# Altium project all-in-one-board-for-open-inverter-project--main.PrjPcb (part 2 of 2)

## Sheet Mosfets.SchDoc
size A3
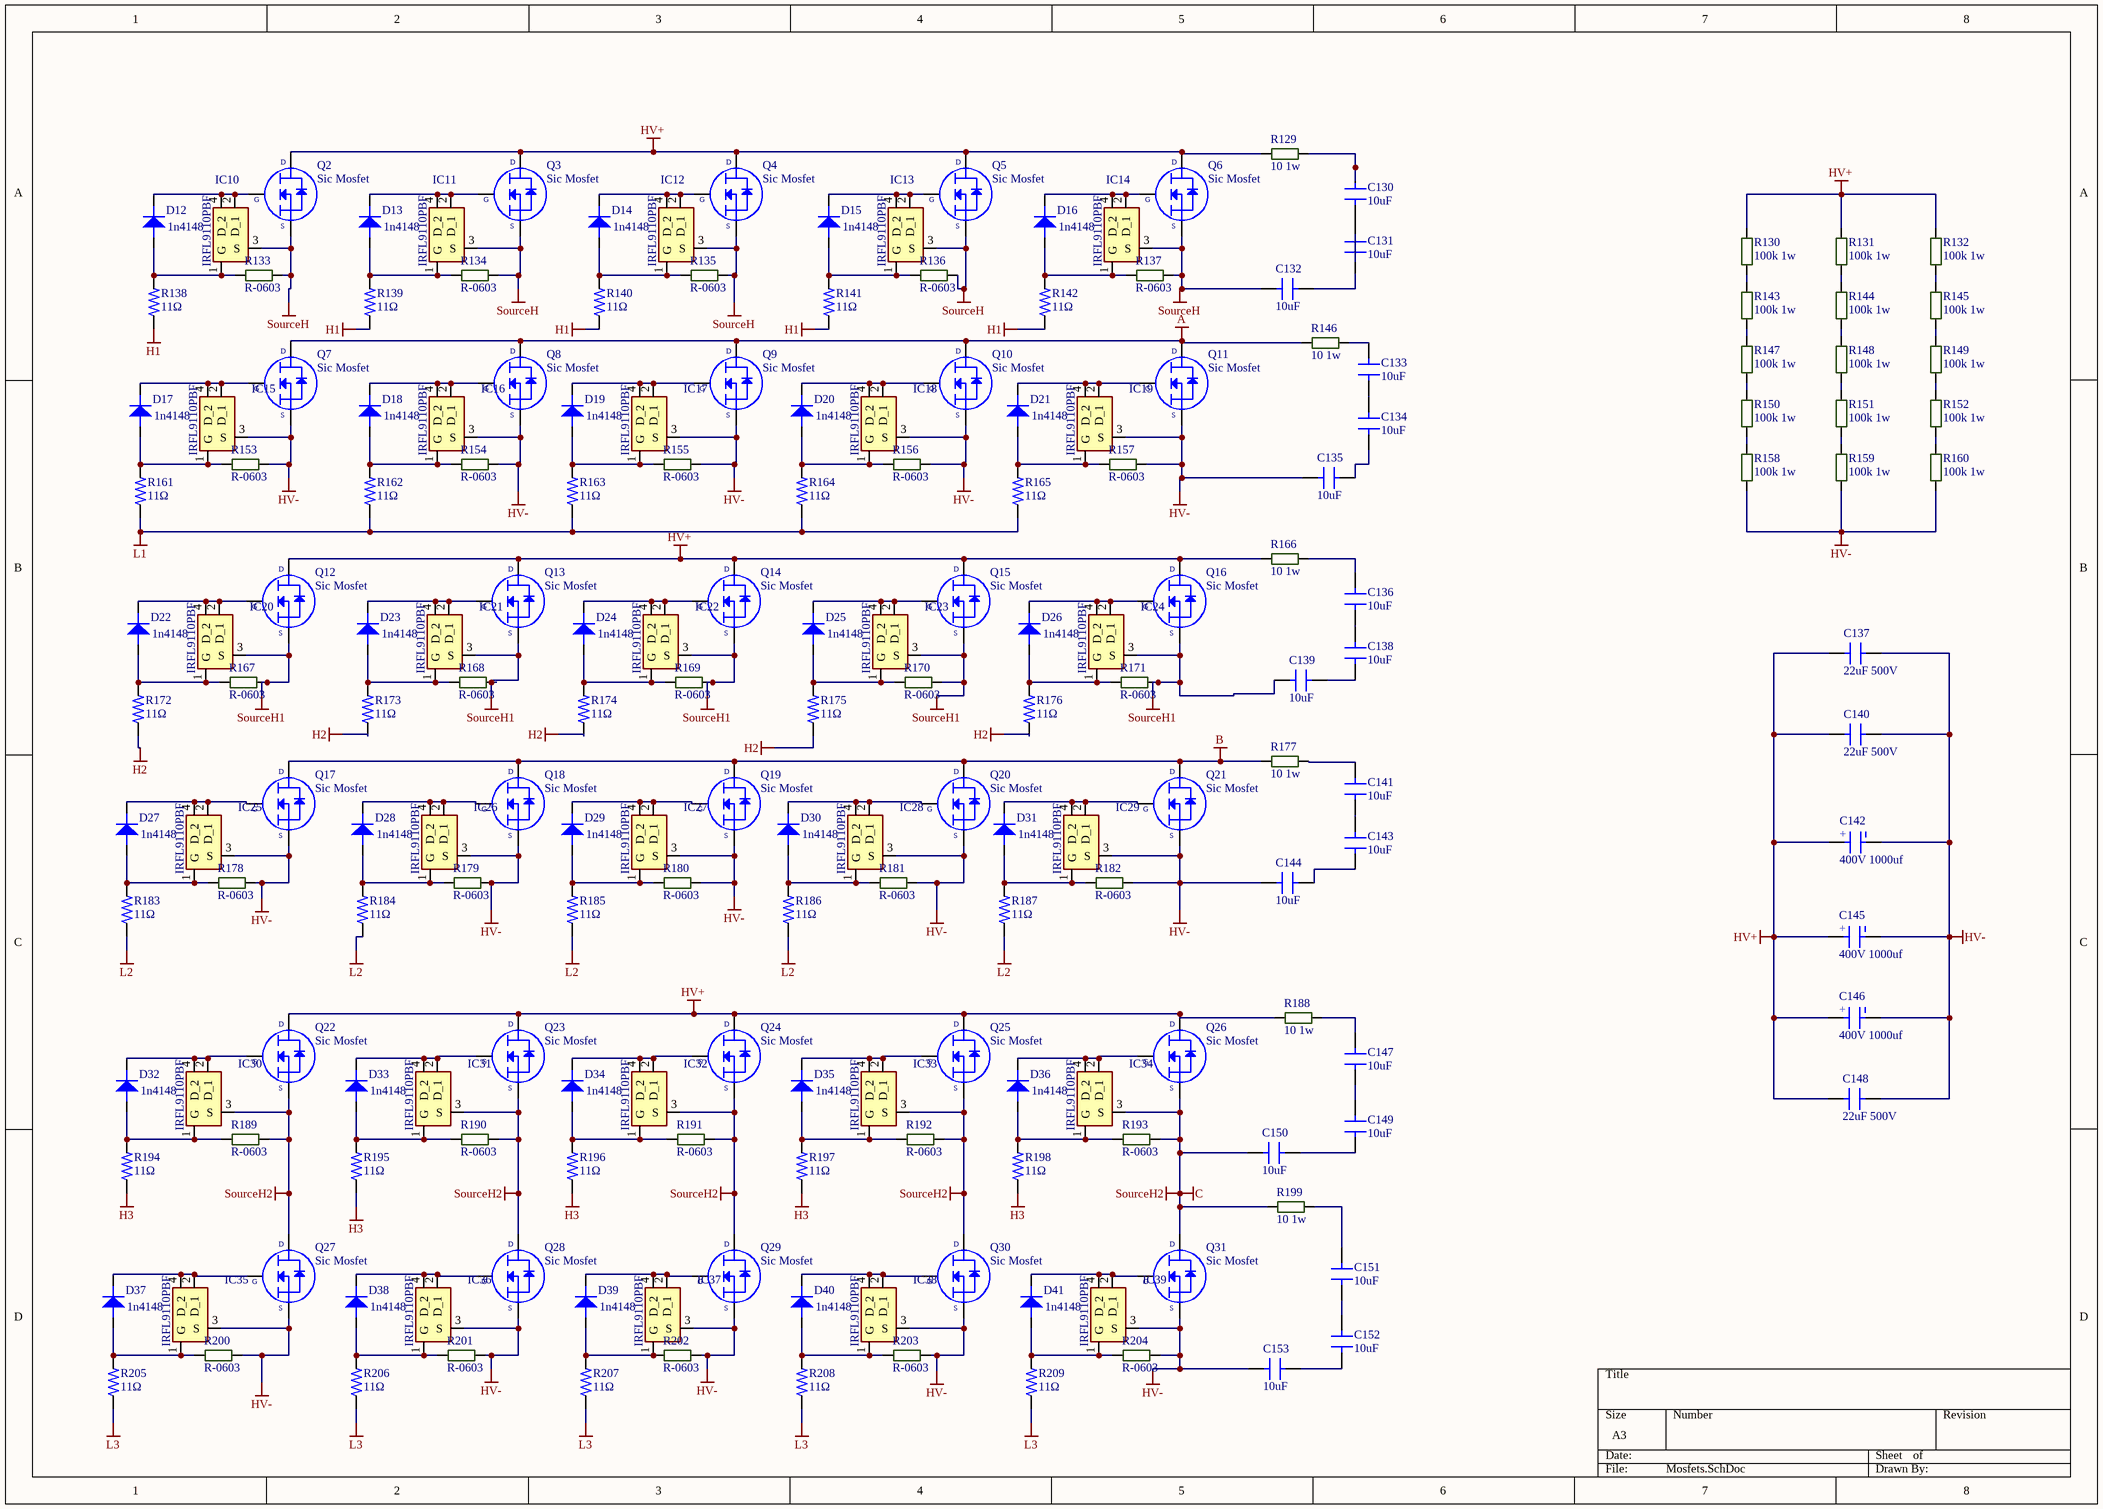
[diagram p12: Mosfets.SchDoc]

### Parts
C130  10uF  [C-2220R]
C131  10uF  [C-2220R]
C132  10uF  [C-2220R]
C133  10uF  [C-2220R]
C134  10uF  [C-2220R]
C135  10uF  [C-2220R]
C136  10uF  [C-2220R]
C137  22uF 500V  [CAP.POL 22UF 500VDC - duplicate]
C138  10uF  [C-2220R]
C139  10uF  [C-2220R]
C140  22uF 500V  [CAP.POL 22UF 500VDC - duplicate]
C141  10uF  [C-2220R]
C142  400V 1000uf  [Koshin 63v 4700 cap]
C143  10uF  [C-2220R]
C144  10uF  [C-2220R]
C145  400V 1000uf  [Koshin 63v 4700 cap]
C146  400V 1000uf  [Koshin 63v 4700 cap]
C147  10uF  [C-2220R]
C148  22uF 500V  [CAP.POL 22UF 500VDC - duplicate]
C149  10uF  [C-2220R]
C150  10uF  [C-2220R]
C151  10uF  [C-2220R]
C152  10uF  [C-2220R]
C153  10uF  [C-2220R]
D12  1n4148  [SOD123]
D13  1n4148  [SOD123]
D14  1n4148  [SOD123]
D15  1n4148  [SOD123]
D16  1n4148  [SOD123]
D17  1n4148  [SOD123]
D18  1n4148  [SOD123]
D19  1n4148  [SOD123]
D20  1n4148  [SOD123]
D21  1n4148  [SOD123]
D22  1n4148  [SOD123]
D23  1n4148  [SOD123]
D24  1n4148  [SOD123]
D25  1n4148  [SOD123]
D26  1n4148  [SOD123]
D27  1n4148  [SOD123]
D28  1n4148  [SOD123]
D29  1n4148  [SOD123]
D30  1n4148  [SOD123]
D31  1n4148  [SOD123]
D32  1n4148  [SOD123]
D33  1n4148  [SOD123]
D34  1n4148  [SOD123]
D35  1n4148  [SOD123]
D36  1n4148  [SOD123]
D37  1n4148  [SOD123]
D38  1n4148  [SOD123]
D39  1n4148  [SOD123]
D40  1n4148  [SOD123]
D41  1n4148  [SOD123]
IC10  IRFL9110PBF  [SOT230P700X180-4N]
IC11  IRFL9110PBF  [SOT230P700X180-4N]
IC12  IRFL9110PBF  [SOT230P700X180-4N]
IC13  IRFL9110PBF  [SOT230P700X180-4N]
IC14  IRFL9110PBF  [SOT230P700X180-4N]
IC15  IRFL9110PBF  [SOT230P700X180-4N]
IC16  IRFL9110PBF  [SOT230P700X180-4N]
IC17  IRFL9110PBF  [SOT230P700X180-4N]
IC18  IRFL9110PBF  [SOT230P700X180-4N]
IC19  IRFL9110PBF  [SOT230P700X180-4N]
IC20  IRFL9110PBF  [SOT230P700X180-4N]
IC21  IRFL9110PBF  [SOT230P700X180-4N]
IC22  IRFL9110PBF  [SOT230P700X180-4N]
IC23  IRFL9110PBF  [SOT230P700X180-4N]
IC24  IRFL9110PBF  [SOT230P700X180-4N]
IC25  IRFL9110PBF  [SOT230P700X180-4N]
IC26  IRFL9110PBF  [SOT230P700X180-4N]
IC27  IRFL9110PBF  [SOT230P700X180-4N]
IC28  IRFL9110PBF  [SOT230P700X180-4N]
IC29  IRFL9110PBF  [SOT230P700X180-4N]
IC30  IRFL9110PBF  [SOT230P700X180-4N]
IC31  IRFL9110PBF  [SOT230P700X180-4N]
IC32  IRFL9110PBF  [SOT230P700X180-4N]
IC33  IRFL9110PBF  [SOT230P700X180-4N]
IC34  IRFL9110PBF  [SOT230P700X180-4N]
IC35  IRFL9110PBF  [SOT230P700X180-4N]
IC36  IRFL9110PBF  [SOT230P700X180-4N]
IC37  IRFL9110PBF  [SOT230P700X180-4N]
IC38  IRFL9110PBF  [SOT230P700X180-4N]
IC39  IRFL9110PBF  [SOT230P700X180-4N]
Q2  Sic Mosfet  [247]
Q3  Sic Mosfet  [247]
Q4  Sic Mosfet  [247]
Q5  Sic Mosfet  [247]
Q6  Sic Mosfet  [247]
Q7  Sic Mosfet  [247]
Q8  Sic Mosfet  [247]
Q9  Sic Mosfet  [247]
Q10  Sic Mosfet  [247]
Q11  Sic Mosfet  [247]
Q12  Sic Mosfet  [247]
Q13  Sic Mosfet  [247]
Q14  Sic Mosfet  [247]
Q15  Sic Mosfet  [247]
Q16  Sic Mosfet  [247]
Q17  Sic Mosfet  [247]
Q18  Sic Mosfet  [247]
Q19  Sic Mosfet  [247]
Q20  Sic Mosfet  [247]
Q21  Sic Mosfet  [247]
Q22  Sic Mosfet  [247]
Q23  Sic Mosfet  [247]
Q24  Sic Mosfet  [247]
Q25  Sic Mosfet  [247]
Q26  Sic Mosfet  [247]
Q27  Sic Mosfet  [247]
Q28  Sic Mosfet  [247]
Q29  Sic Mosfet  [247]
Q30  Sic Mosfet  [247]
Q31  Sic Mosfet  [247]
R129  10 1w  [R-2512]
R130  100k 1w  [R-2512]
R131  100k 1w  [R-2512]
R132  100k 1w  [R-2512]
R133  R-0603  [R-0603R]
R134  R-0603  [R-0603R]
R135  R-0603  [R-0603R]
R136  R-0603  [R-0603R]
R137  R-0603  [R-0603R]
R138  11Ω  [R-1206W]
R139  11Ω  [R-1206W]
R140  11Ω  [R-1206W]
R141  11Ω  [R-1206W]
R142  11Ω  [R-1206W]
R143  100k 1w  [R-2512]
R144  100k 1w  [R-2512]
R145  100k 1w  [R-2512]
R146  10 1w  [R-2512]
R147  100k 1w  [R-2512]
R148  100k 1w  [R-2512]
R149  100k 1w  [R-2512]
R150  100k 1w  [R-2512]
R151  100k 1w  [R-2512]
R152  100k 1w  [R-2512]
R153  R-0603  [R-0603R]
R154  R-0603  [R-0603R]
R155  R-0603  [R-0603R]
R156  R-0603  [R-0603R]
R157  R-0603  [R-0603R]
R158  100k 1w  [R-2512]
R159  100k 1w  [R-2512]
R160  100k 1w  [R-2512]
R161  11Ω  [R-1206W]
R162  11Ω  [R-1206W]
R163  11Ω  [R-1206W]
R164  11Ω  [R-1206W]
R165  11Ω  [R-1206W]
R166  10 1w  [R-2512]
R167  R-0603  [R-0603R]
R168  R-0603  [R-0603R]
R169  R-0603  [R-0603R]
R170  R-0603  [R-0603R]
R171  R-0603  [R-0603R]
R172  11Ω  [R-1206W]
R173  11Ω  [R-1206W]
R174  11Ω  [R-1206W]
R175  11Ω  [R-1206W]
R176  11Ω  [R-1206W]
R177  10 1w  [R-2512]
R178  R-0603  [R-0603R]
R179  R-0603  [R-0603R]
R180  R-0603  [R-0603R]
R181  R-0603  [R-0603R]
R182  R-0603  [R-0603R]
R183  11Ω  [R-1206W]
R184  11Ω  [R-1206W]
R185  11Ω  [R-1206W]
R186  11Ω  [R-1206W]
R187  11Ω  [R-1206W]
R188  10 1w  [R-2512]
R189  R-0603  [R-0603R]
R190  R-0603  [R-0603R]
R191  R-0603  [R-0603R]
R192  R-0603  [R-0603R]
R193  R-0603  [R-0603R]
R194  11Ω  [R-1206W]
R195  11Ω  [R-1206W]
R196  11Ω  [R-1206W]
R197  11Ω  [R-1206W]
R198  11Ω  [R-1206W]
R199  10 1w  [R-2512]
R200  R-0603  [R-0603R]
R201  R-0603  [R-0603R]
R202  R-0603  [R-0603R]
R203  R-0603  [R-0603R]
R204  R-0603  [R-0603R]
R205  11Ω  [R-1206W]
R206  11Ω  [R-1206W]
R207  11Ω  [R-1206W]
R208  11Ω  [R-1206W]
R209  11Ω  [R-1206W]

### Nets
A: C132.2 IC10.3(S) IC11.3(S) IC12.3(S) IC13.3(S) IC14.3(S) Q2.3 Q3.3 Q4.3 Q5.3 Q6.3 Q7.2 Q8.2 Q9.2 Q10.2 Q11.2 R133.2 R134.2 R135.2 R136.2 R137.2 R146.2  [also labelled SourceH]
B: C139.1 IC20.3(S) IC21.3(S) IC22.3(S) IC23.3(S) IC24.3(S) Q12.3 Q13.3 Q14.3 Q15.3 Q16.3 Q17.2 Q18.2 Q19.2 Q20.2 Q21.2 R167.2 R168.2 R169.2 R170.2 R171.2 R177.2  [also labelled SourceH1]
C: C150.1 IC30.3(S) IC31.3(S) IC32.3(S) IC33.3(S) IC34.3(S) Q22.3 Q23.3 Q24.3 Q25.3 Q26.3 Q27.2 Q28.2 Q29.2 Q30.2 Q31.2 R189.2 R190.2 R191.2 R192.2 R193.2 R199.2  [also labelled SourceH2]
H1: R138.1 R139.1 R140.1 R141.1 R142.1
H2: R172.1 R173.1 R174.1 R175.1 R176.1
H3: R194.1 R195.1 R196.1 R197.1 R198.1
HV+: C137.1 C140.1 C142.2 C145.2 C146.2 C148.1 Q2.2 Q3.2 Q4.2 Q5.2 Q6.2 Q12.2 Q13.2 Q14.2 Q15.2 Q16.2 Q22.2 Q23.2 Q24.2 Q25.2 Q26.2 R129.2 R130.1 R131.1 R132.1 R166.2 R188.2
HV-: C135.1 C137.2 C140.2 C142.1 C144.1 C145.1 C146.1 C148.2 C153.2 IC15.3(S) IC16.3(S) IC17.3(S) IC18.3(S) IC19.3(S) IC25.3(S) IC26.3(S) IC27.3(S) IC28.3(S) IC29.3(S) IC35.3(S) IC36.3(S) IC37.3(S) IC38.3(S) IC39.3(S) Q7.3 Q8.3 Q9.3 Q10.3 Q11.3 Q17.3 Q18.3 Q19.3 Q20.3 Q21.3 Q27.3 Q28.3 Q29.3 Q30.3 Q31.3 R153.2 R154.2 R155.2 R156.2 R157.2 R158.2 R159.2 R160.2 R178.2 R179.2 R180.2 R181.2 R182.2 R200.2 R201.2 R202.2 R203.2 R204.2
L1: R161.1 R162.1 R163.1 R164.1 R165.1
L2: R183.1 R184.1 R185.1 R186.1 R187.1
L3: R205.1 R206.1 R207.1 R208.1 R209.1
NetC130_1: C130.1 C131.2
NetC130_2: C130.2 R129.1
NetC131_1: C131.1 C132.1
NetC133_1: C133.1 C134.2
NetC133_2: C133.2 R146.1
NetC134_1: C134.1 C135.2
NetC136_1: C136.1 C138.2
NetC136_2: C136.2 R166.1
NetC138_1: C138.1 C139.2
NetC141_1: C141.1 C143.2
NetC141_2: C141.2 R177.1
NetC143_1: C143.1 C144.2
NetC147_1: C147.1 C149.2
NetC147_2: C147.2 R188.1
NetC149_1: C149.1 C150.2
NetC151_1: C151.1 C152.2
NetC151_2: C151.2 R199.1
NetC152_1: C152.1 C153.1
NetD12_a: D12.a IC10.1(G) R133.1 R138.2
NetD12_k: D12.k IC10.2(D_1) IC10.4(D_2) Q2.1
NetD13_a: D13.a IC11.1(G) R134.1 R139.2
NetD13_k: D13.k IC11.2(D_1) IC11.4(D_2) Q3.1
NetD14_a: D14.a IC12.1(G) R135.1 R140.2
NetD14_k: D14.k IC12.2(D_1) IC12.4(D_2) Q4.1
NetD15_a: D15.a IC13.1(G) R136.1 R141.2
NetD15_k: D15.k IC13.2(D_1) IC13.4(D_2) Q5.1
NetD16_a: D16.a IC14.1(G) R137.1 R142.2
NetD16_k: D16.k IC14.2(D_1) IC14.4(D_2) Q6.1
NetD17_a: D17.a IC15.1(G) R153.1 R161.2
NetD17_k: D17.k IC15.2(D_1) IC15.4(D_2) Q7.1
NetD18_a: D18.a IC16.1(G) R154.1 R162.2
NetD18_k: D18.k IC16.2(D_1) IC16.4(D_2) Q8.1
NetD19_a: D19.a IC17.1(G) R155.1 R163.2
NetD19_k: D19.k IC17.2(D_1) IC17.4(D_2) Q9.1
NetD20_a: D20.a IC18.1(G) R156.1 R164.2
NetD20_k: D20.k IC18.2(D_1) IC18.4(D_2) Q10.1
NetD21_a: D21.a IC19.1(G) R157.1 R165.2
NetD21_k: D21.k IC19.2(D_1) IC19.4(D_2) Q11.1
NetD22_a: D22.a IC20.1(G) R167.1 R172.2
NetD22_k: D22.k IC20.2(D_1) IC20.4(D_2) Q12.1
NetD23_a: D23.a IC21.1(G) R168.1 R173.2
NetD23_k: D23.k IC21.2(D_1) IC21.4(D_2) Q13.1
NetD24_a: D24.a IC22.1(G) R169.1 R174.2
NetD24_k: D24.k IC22.2(D_1) IC22.4(D_2) Q14.1
NetD25_a: D25.a IC23.1(G) R170.1 R175.2
NetD25_k: D25.k IC23.2(D_1) IC23.4(D_2) Q15.1
NetD26_a: D26.a IC24.1(G) R171.1 R176.2
NetD26_k: D26.k IC24.2(D_1) IC24.4(D_2) Q16.1
NetD27_a: D27.a IC25.1(G) R178.1 R183.2
NetD27_k: D27.k IC25.2(D_1) IC25.4(D_2) Q17.1
NetD28_a: D28.a IC26.1(G) R179.1 R184.2
NetD28_k: D28.k IC26.2(D_1) IC26.4(D_2) Q18.1
NetD29_a: D29.a IC27.1(G) R180.1 R185.2
NetD29_k: D29.k IC27.2(D_1) IC27.4(D_2) Q19.1
NetD30_a: D30.a IC28.1(G) R181.1 R186.2
NetD30_k: D30.k IC28.2(D_1) IC28.4(D_2) Q20.1
NetD31_a: D31.a IC29.1(G) R182.1 R187.2
NetD31_k: D31.k IC29.2(D_1) IC29.4(D_2) Q21.1
NetD32_a: D32.a IC30.1(G) R189.1 R194.2
NetD32_k: D32.k IC30.2(D_1) IC30.4(D_2) Q22.1
NetD33_a: D33.a IC31.1(G) R190.1 R195.2
NetD33_k: D33.k IC31.2(D_1) IC31.4(D_2) Q23.1
NetD34_a: D34.a IC32.1(G) R191.1 R196.2
NetD34_k: D34.k IC32.2(D_1) IC32.4(D_2) Q24.1
NetD35_a: D35.a IC33.1(G) R192.1 R197.2
NetD35_k: D35.k IC33.2(D_1) IC33.4(D_2) Q25.1
NetD36_a: D36.a IC34.1(G) R193.1 R198.2
NetD36_k: D36.k IC34.2(D_1) IC34.4(D_2) Q26.1
NetD37_a: D37.a IC35.1(G) R200.1 R205.2
NetD37_k: D37.k IC35.2(D_1) IC35.4(D_2) Q27.1
NetD38_a: D38.a IC36.1(G) R201.1 R206.2
NetD38_k: D38.k IC36.2(D_1) IC36.4(D_2) Q28.1
NetD39_a: D39.a IC37.1(G) R202.1 R207.2
NetD39_k: D39.k IC37.2(D_1) IC37.4(D_2) Q29.1
NetD40_a: D40.a IC38.1(G) R203.1 R208.2
NetD40_k: D40.k IC38.2(D_1) IC38.4(D_2) Q30.1
NetD41_a: D41.a IC39.1(G) R204.1 R209.2
NetD41_k: D41.k IC39.2(D_1) IC39.4(D_2) Q31.1
NetR130_2: R130.2 R143.1
NetR131_2: R131.2 R144.1
NetR132_2: R132.2 R145.1
NetR143_2: R143.2 R147.1
NetR144_2: R144.2 R148.1
NetR145_2: R145.2 R149.1
NetR147_2: R147.2 R150.1
NetR148_2: R148.2 R151.1
NetR149_2: R149.2 R152.1
NetR150_2: R150.2 R158.1
NetR151_2: R151.2 R159.1
NetR152_2: R152.2 R160.1

### Notes on the sheet
- (in symbol Aluminum Electrolytic Capacitors) +
- (in symbol Sic Mosfet To247) D; G; S

### Library data of the parts
C130-C136 C138 C139 C141 C143 C144 C147 C149-C153 = Cap2220: 2220; Özdisan Part Number: CL31B475KBHNNNE; Manufacturer: SAMSUNG; Link: https://www.ozdisan.com/pasif-komponentler/kondansatorler/smd-kondansatorler-mlcc/CL31B475KBHNNNE; Price: 0,10407
C137 C140 C148 = CAP.POL 22UF 500VDC: ComponentLink1Description: https://www.ozdisan.com/pasif-komponentler/kondansatorler/film-kondansatorler/C3D2H226JB00C00; ComponentLink1URL: https://www.ozdisan.com/pasif-komponentler/kondansatorler/film-kondansatorler/C3D2H226JB00C00
C142 C145 C146 = Aluminum Electrolytic Capacitors: Manufacturer: Nichicon; Manufacturer Part Number: LKS1J472MESZ; Capacitance: 4.7mF; Voltage Rating: 63V; Tolerance: 20%; Ripple Current: 3A; Life (Hours): 1000Hour; Supplier 1: Mouser; RoHS: Yes; Mount: Through Hole; Case/Package: Radial; Min Operating Temperature: -40°C; Max Operating Temperature: 85°C; Package Quantity: 250; Packaging: Bulk; Voltage Rating (DC): 63V; Termination: Snap in; Diameter: 22mm; Length: 45mm; Lead Pitch: 0.394inch; Height - Seated (Max): 1.772inch; Supplier Part Number 1: 647-LKS1J472MESZ; ComponentLink2Description: https://www.ozdisan.com/pasif-komponentler/kondansatorler/aluminyum-kondansatorler/PKL5-063V472MM450; ComponentLink2URL: https://www.ozdisan.com/pasif-komponentler/kondansatorler/aluminyum-kondansatorler/PKL5-063V472MM450
D12-D41 = 1N4148W-E3-18: Diode Small Signal Switching 100V 0.15A 2-Pin SOD-123 T/R; Manufacturer: Vishay; Recovery Time: 4ns; Max Power Dissipation: 350mW; Forward Current: 150mA; Max Surge Current: 2A; Forward Voltage: 1.2V; Max Reverse Leakage Current: 5uA; Element Configuration: Single; Max Reverse Voltage (DC): 75V; Peak Reverse Current: 100uA; Supplier 1: Allied Electronics; Manufacturer Part Number: 1N4148W-E3-18; RoHS: Yes; Stock 1: 6838; Pricing 1: 1 = 0.03900, 25 = 0.03800, 100 = 0.03600, 250 = 0.03400, 500 = 0.03200, 1000 = 0.03100, 2500 = 0.02900 (USD); Mount: Surface Mount; Number of Pins: 2; Weight: 0.000363oz; Contact Plating: Tin; Min Operating Temperature: -55°C; Max Operating Temperature: 150°C; Packaging: Tape and Reel; Package Quantity: 10000; Average Rectified Current: 150mA; Reverse Recovery Time: 4ns; Power Dissipation: 350mW; Max Repetitive Reverse Voltage (Vrrm): 100V; Peak Non-Repetitive Surge Current: 2A; Length: 2.85mm; Height: 1.25mm; Width: 1.7mm; Radiation Hardening: No; Lead Free: Lead Free; ComponentLink1URL: https://datasheet.ciiva.com/29885/1n4148w-29885941.pdf?src-supplier=Avnet; ComponentLink1Description: https://datasheet.ciiva.com/29885/1n4148w-29885941.pdf?src-supplier=Avnet; ComponentLink2URL: https://datasheet.ciiva.com/29593/1n4148w-29593113.pdf?src-supplier=Digi-Key; ComponentLink2Description: https://datasheet.ciiva.com/29593/1n4148w-29593113.pdf?src-supplier=Digi-Key; ComponentLink3URL: https://datasheet.ciiva.com/29593/1n4148w-29593111.pdf?src-supplier=Digi-Key; ComponentLink3Description: https://datasheet.ciiva.com/29593/1n4148w-29593111.pdf?src-supplier=Digi-Key; ComponentLink4URL: https://datasheet.ciiva.com/29593/1n4148w-29593112.pdf?src-supplier=Digi-Key; ComponentLink4Description: https://datasheet.ciiva.com/29593/1n4148w-29593112.pdf?src-supplier=Digi-Key; Supplier Part Number 1: 70061597
IC10-IC39 = IRFL9110PBF: Integrated Circuit; Manufacturer_Name: Vishay; Datasheet Link: http://www.vishay.com/docs/91196/sihfl911.pdf; Height: 1.8mm; Manufacturer_Part_Number: IRFL9110PBF; Mouser Part Number: 844-IRFL9110PBF; Mouser Price/Stock: https://www.mouser.com/Search/Refine.aspx?Keyword=844-IRFL9110PBF
Q2-Q31 = Sic Mosfet To247
R129 R146 R166 R177 R188 R199 = R-2512
R130-R132 R143-R145 R147-R152 R158-R160 = R-2512: 10 1w
R138-R142 R161-R165 R172-R176 R183-R187 R194-R198 R205-R209 = RES 11Ω 1206: CRG1206 1% 11R; MP: 1623463-1; Package: None; Price: None; Value: *; Availability: Unavailable

## Nets that join several sheets
+3.3V: Main MCU (13 pins), Voltage Regulation (5 pins), Communication (8 pins)
+5V: Main MCU (7 pins), Automotive Connector (R56.2), Voltage Regulation (6 pins), Current Voltage Sensors (11 pins), Input Filtering (R118.2 R120.2 R122.2)
+12V: Gate Driver 1 (C2.2 C12.2 L1.1 L2.1), Gate Driver 2 (C23.2 C32.2 L3.1 L4.1), Gate Driver 3 (C42.2 C52.2 L5.1 L6.1), Automotive Connector (J1.35), Voltage Regulation (6 pins), Output Driver (SJ2.2)
+48V: Automotive Connector (J1.10), Voltage Regulation (R70.2 R71.2)
A: Gate Driver 1 (7 pins), Mosfets (22 pins)
B: Gate Driver 2 (7 pins), Mosfets (22 pins)
C: Gate Driver 3 (7 pins), Mosfets (22 pins)
GND: Gate Driver 1 (8 pins), Gate Driver 2 (8 pins), Gate Driver 3 (8 pins), Main MCU (33 pins), Automotive Connector (C83.1 J1.23 R57.1), PWM Filter (12 pins), Voltage Regulation (26 pins), Output Driver (IC6.7 IC6.8 T1.3), Communication (9 pins), Current Voltage Sensors (22 pins), Input Filtering (24 pins)
H1: Gate Driver 1 (R1.2 R3.2 R5.2), Mosfets (5 pins)
H2: Gate Driver 2 (R15.2 R17.2 R19.2), Mosfets (5 pins)
H3: Gate Driver 3 (R29.2 R31.2 R33.2), Mosfets (5 pins)
HV+: Current Voltage Sensors (R92.2), Mosfets (27 pins)
HV-: Gate Driver 1 (7 pins), Gate Driver 2 (7 pins), Gate Driver 3 (7 pins), Current Voltage Sensors (5 pins), Mosfets (57 pins)
L1: Gate Driver 1 (R9.2 R11.2 R14.2), Mosfets (5 pins)
L2: Gate Driver 2 (R23.2 R25.2 R27.2), Mosfets (5 pins)
L3: Gate Driver 3 (R37.2 R39.2 R41.2), Mosfets (5 pins)
CANH: Automotive Connector (J1.16), Communication (IC7.7)
CANL: Automotive Connector (J1.15), Communication (IC7.6)
ENC_A/S2: Automotive Connector (J1.1), Input Filtering (R126.1 SJ4.1)
ENC_B/S3: Automotive Connector (J1.2), Input Filtering (R119.1 SJ3.1)
ENC_Z/R1: Main MCU (C76.2), Automotive Connector (J1.3)
MTEMP+: Automotive Connector (J1.24), Input Filtering (R120.1)
MTEMP-: Automotive Connector (J1.13), Input Filtering (R124.1 R125.2)
OUT_BRAKE: Automotive Connector (J1.5), Output Driver (IC6.11)
OUT_DCSW: Automotive Connector (J1.4), Output Driver (IC6.10 T1.4)
OUT_ERR: Automotive Connector (J1.6), Output Driver (IC6.12)
OUT_OVTMP: Automotive Connector (J1.7), Output Driver (IC6.13)
OUT_PRE: Automotive Connector (J1.9), Output Driver (IC6.15 IC6.16)
OUT_TEMP: Automotive Connector (J1.8), Output Driver (IC6.14)
PA2/ADC2: Main MCU (U13.16), Input Filtering (C122.2 R104.2 R115.2)
PA3/ADC3: Main MCU (IC1.3 U13.17), Input Filtering (C121.2 R105.2 R114.2)
PA4/ADC4: Main MCU (U13.20), Input Filtering (C120.2 R106.2 R113.2)
PA5/ADC5: Main MCU (IC2.5 IC2.8 U13.21), Current Voltage Sensors (C107.2 R83.1 R85.2)
PA6/TIM3_CH1: Main MCU (U13.22), Input Filtering (C128.2 R126.2)
PA7/TIM3_CH2: Main MCU (U13.23), Input Filtering (C125.2 R119.2)
PA8/TIM1_CH1: Main MCU (U13.41), PWM Filter (R58.1)
PA8/TIM1_CH1-Filtered: Gate Driver 1 (R7.1), PWM Filter (C84.2 R58.2 R61.2)
PA9/TIM1_CH2: Main MCU (U13.42), PWM Filter (R59.1)
PA9/TIM1_CH2-Filtered: Gate Driver 2 (R21.1), PWM Filter (C85.2 R59.2 R62.2)
PA10/TIM1_CH3: Main MCU (U13.43), PWM Filter (R60.1)
PA10/TIM1_CH3-Filtered: Gate Driver 3 (R35.1), PWM Filter (C86.2 R60.2 R63.2)
PA11/CANRX: Main MCU (U13.44), Communication (IC7.4)
PA12/CANTX: Main MCU (U13.45), Communication (IC7.1)
PB0/ADC8: Main MCU (IC2.7 IC2.10 U13.26), Current Voltage Sensors (C114.2 R96.1 R98.2)
PB1/ADC9: Main MCU (U13.27), Output Driver (IC6.1 IC6.2)
PB5: Main MCU (U13.57), Input Filtering (C124.2 R102.2 R117.2)
PB6/TIM4_CH1: Main MCU (U13.58), Input Filtering (C123.2 R103.2 R116.2)
PB9/TIM4_CH4: Main MCU (U13.62), Output Driver (IC6.3)
PB10/USART3_TX: Main MCU (U13.29), Communication (CoN2.2 U16.22)
PB11/USART3_RX: Main MCU (U13.30), Communication (CoN2.1 U16.21)
PC0/ADC10: Main MCU (U13.8), Input Filtering (C126.2 R121.2)
PC1/ADC11: Main MCU (U13.9), Input Filtering (C129.2 R127.2)
PC2/ADC12: Main MCU (U13.10), Input Filtering (C127.2 R124.2)
PC3/ADC13: Main MCU (U13.11), Current Voltage Sensors (C109.2 R89.2)
PC4/ADC14: Main MCU (U13.24), Current Voltage Sensors (C116.2 R101.2)
PC5/ADC15: Main MCU (U13.25), Output Driver (IC6.6)
PC6: Main MCU (U13.37), Input Filtering (C119.2 R107.2 R112.2)
PC7: Main MCU (U13.38), Input Filtering (C118.2 R108.2 R111.2)
PC8: Main MCU (U13.39), Input Filtering (C117.2 R109.2 R110.2)
PC10: Main MCU (U13.51), Output Driver (IC6.5)
PC11: Main MCU (U13.52), Output Driver (IC6.4)
PC13: Main MCU (U13.2), Output Driver (T1.1)
SIG_BMS: Automotive Connector (J1.25), Input Filtering (R109.1)
SIG_BRAKE: Automotive Connector (J1.17), Input Filtering (R104.1)
SIG_CRUISE: Automotive Connector (J1.31), Input Filtering (R102.1)
SIG_EMCYSTOP: Automotive Connector (J1.33), Input Filtering (R108.1)
SIG_FORWARD: Automotive Connector (J1.26), Input Filtering (R106.1)
SIG_MPROT: Automotive Connector (J1.19), Input Filtering (R105.1)
SIG_REVERSE: Automotive Connector (J1.27), Input Filtering (R107.1)
SIG_START: Automotive Connector (J1.32), Input Filtering (R103.1)
THROTTLE1: Automotive Connector (J1.12), Input Filtering (R127.1 R128.2)
THROTTLE2: Automotive Connector (J1.11), Input Filtering (R121.1 R123.2)
TIM1_CH1N: Main MCU (U13.34), PWM Filter (R64.1)
TIM1_CH1N-Filtered: Gate Driver 1 (R8.1), PWM Filter (C87.2 R64.2 R67.2)
TIM1_CH2N: Main MCU (U13.35), PWM Filter (R65.1)
TIM1_CH2N-Filtered: Gate Driver 2 (R22.1), PWM Filter (C88.2 R65.2 R68.2)
TIM1_CH3N: Main MCU (U13.36), PWM Filter (R66.1)
TIM1_CH3N-Filtered: Gate Driver 3 (R36.1), PWM Filter (C89.2 R66.2 R69.2)